# Altium schematic sheet Monitait_V2.SchDoc
size 889 x 508 mm
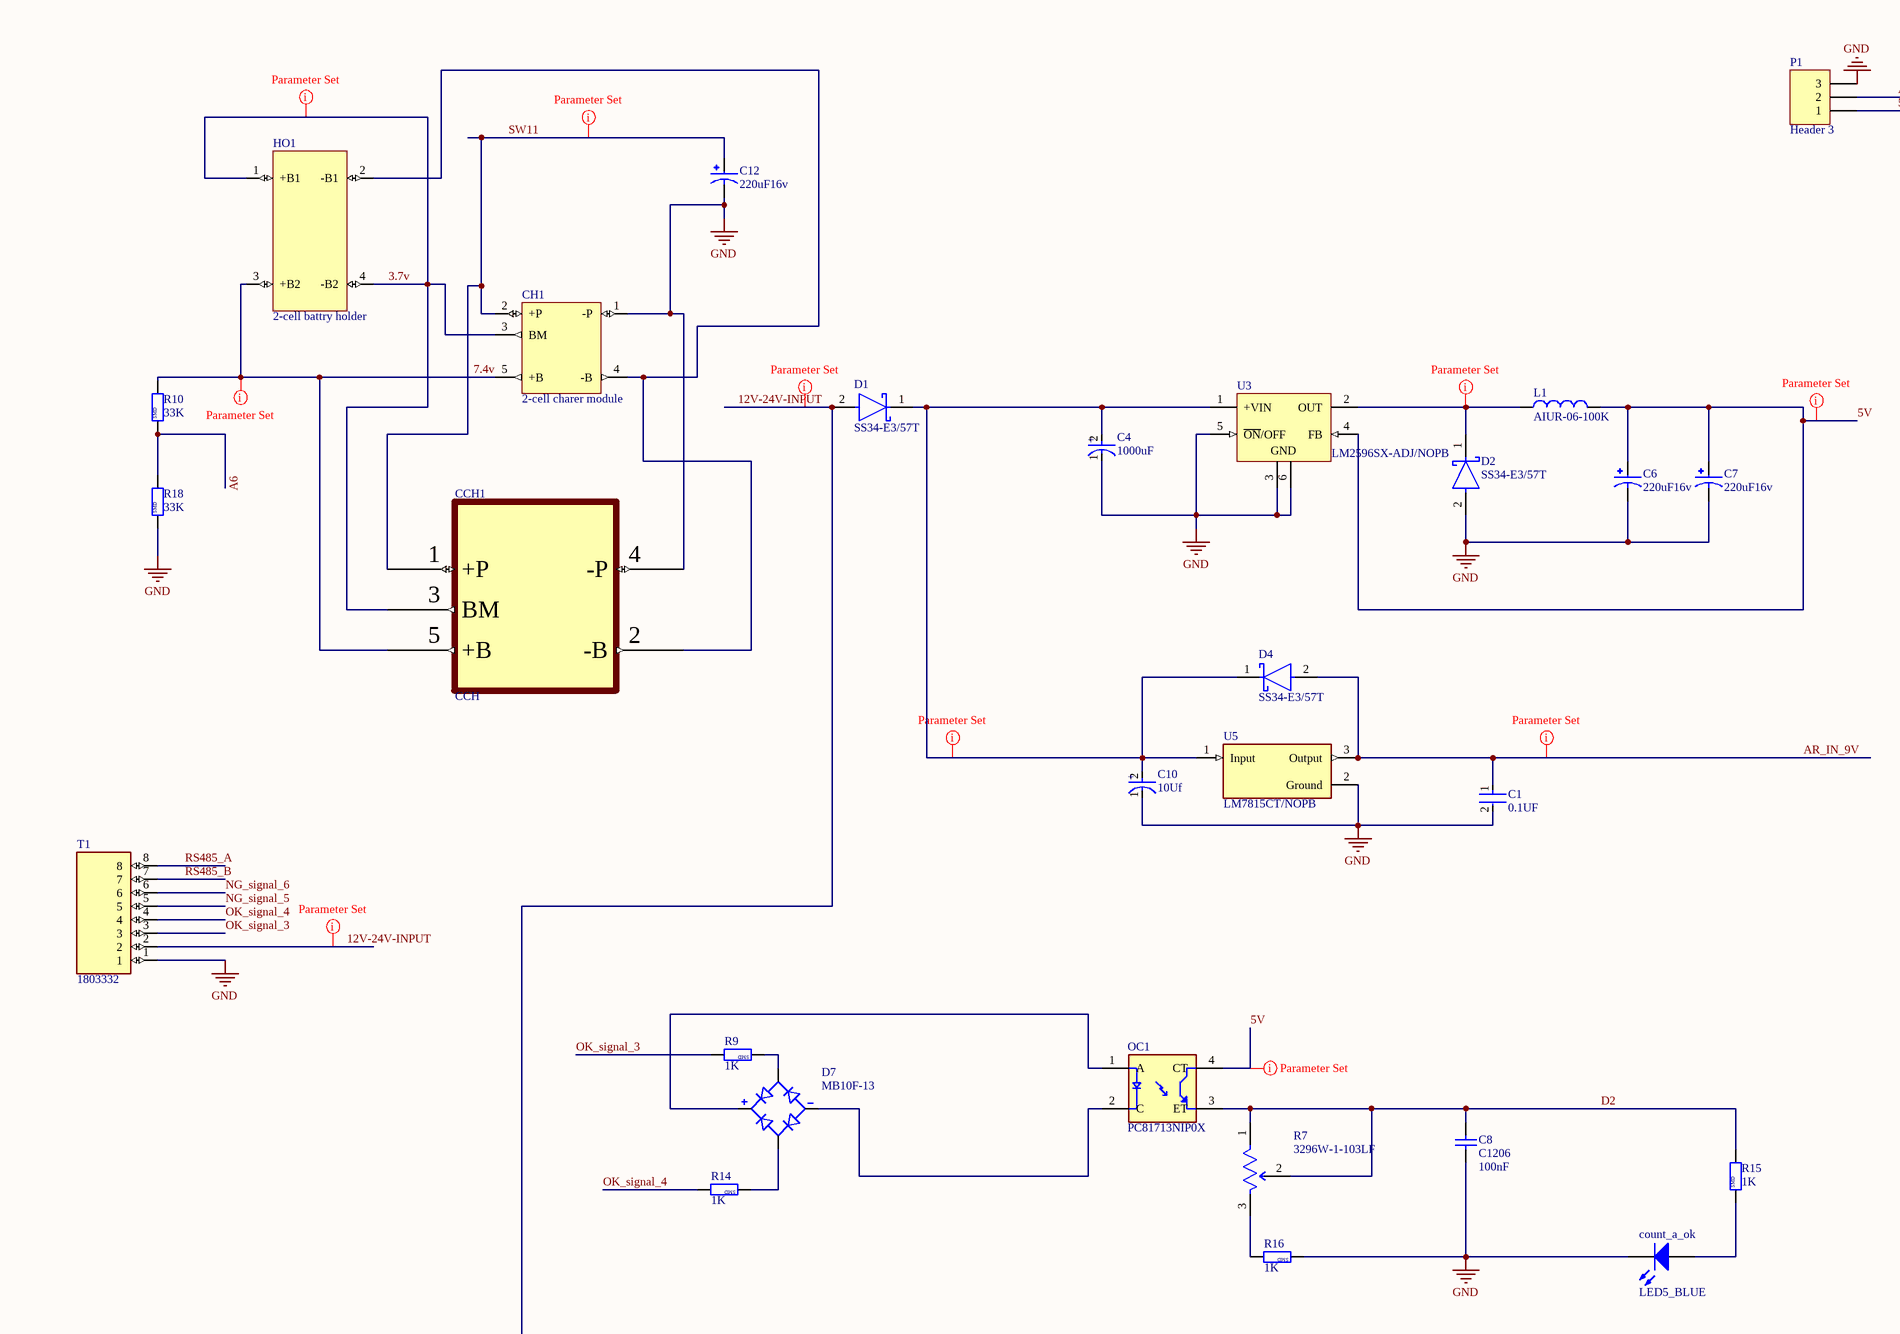
[diagram p0: Monitait_V2.SchDoc, top left]
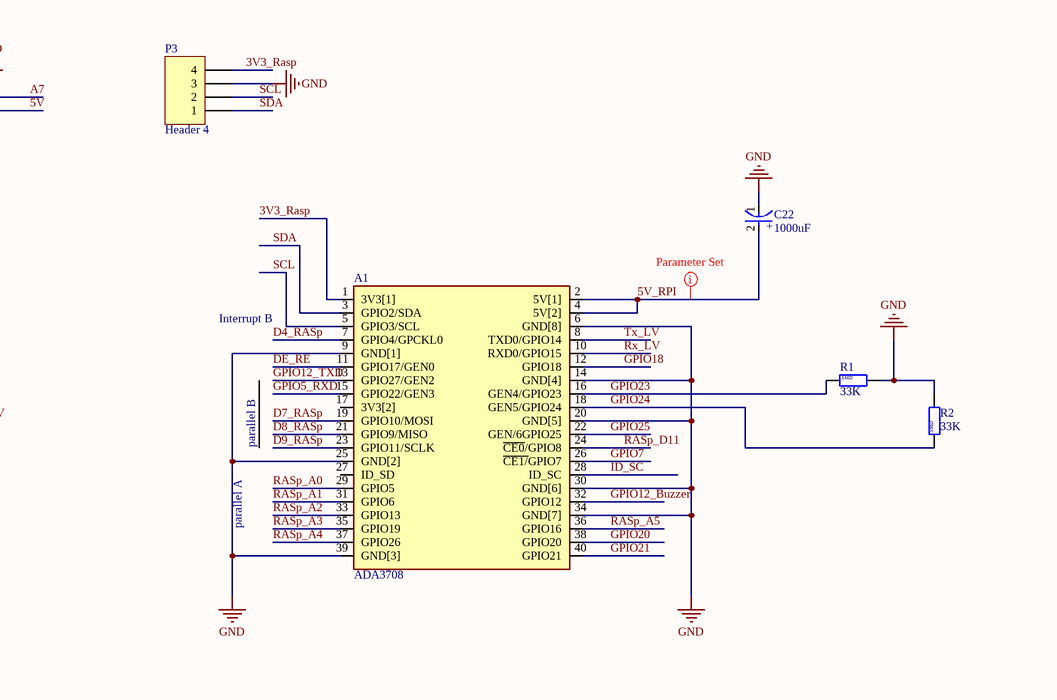
[diagram p1: Monitait_V2.SchDoc, top middle]
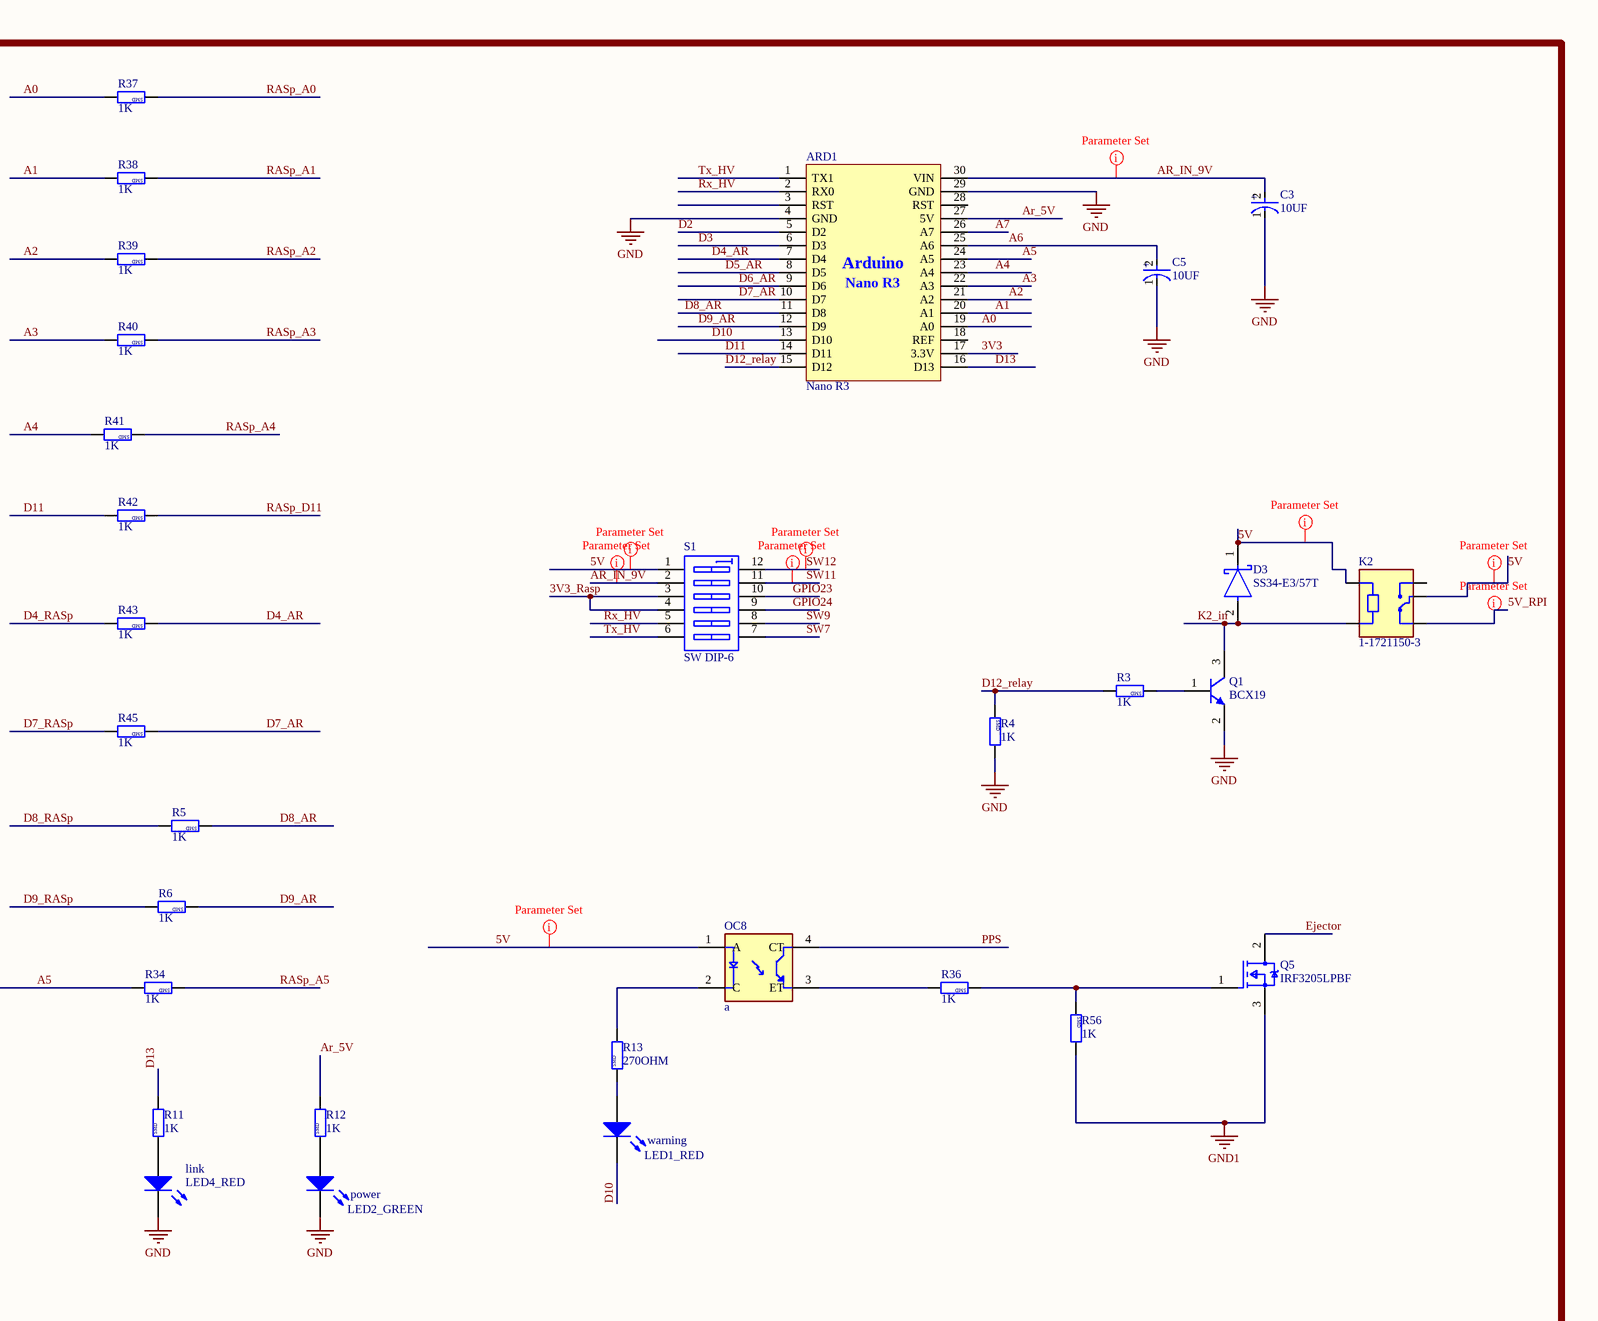
[diagram p2: Monitait_V2.SchDoc, top right]
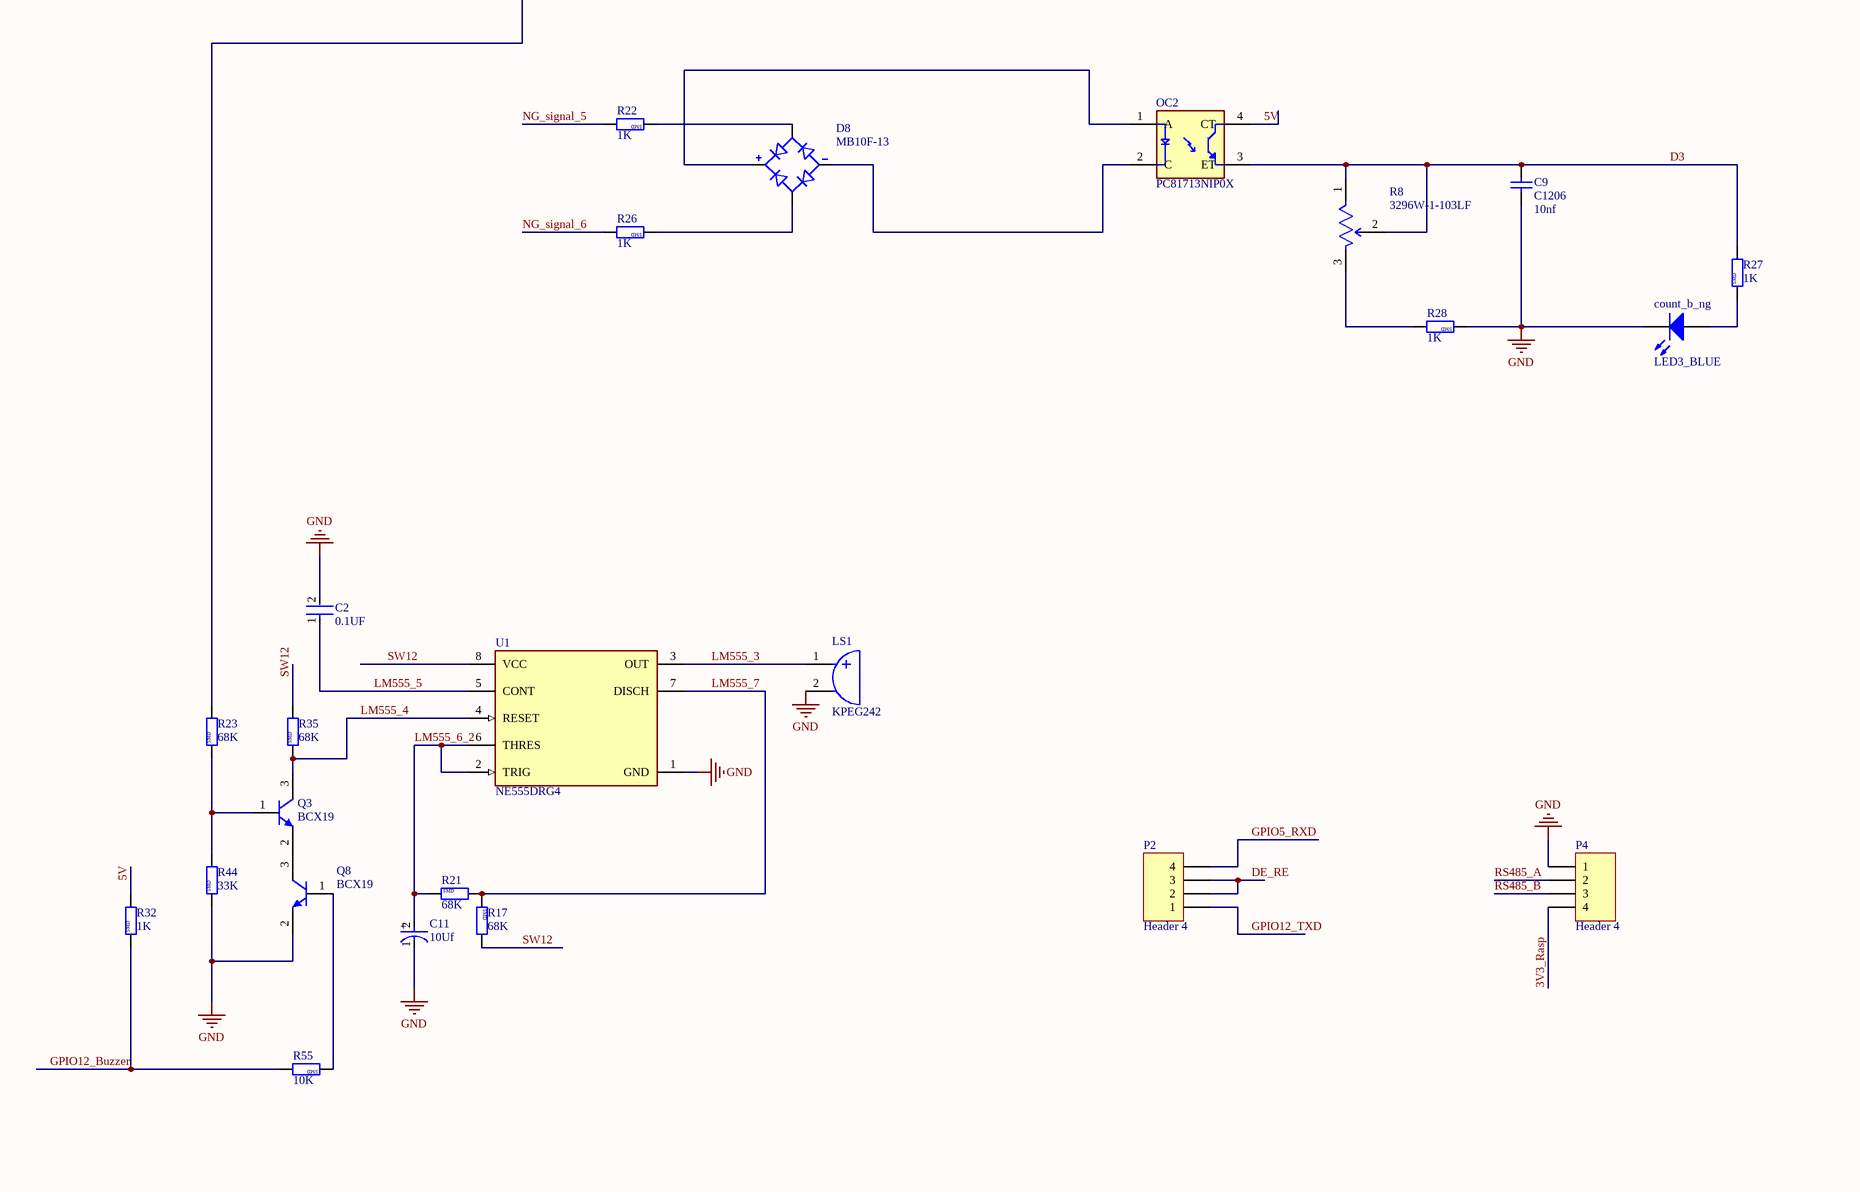
[diagram p3: Monitait_V2.SchDoc, bottom left]
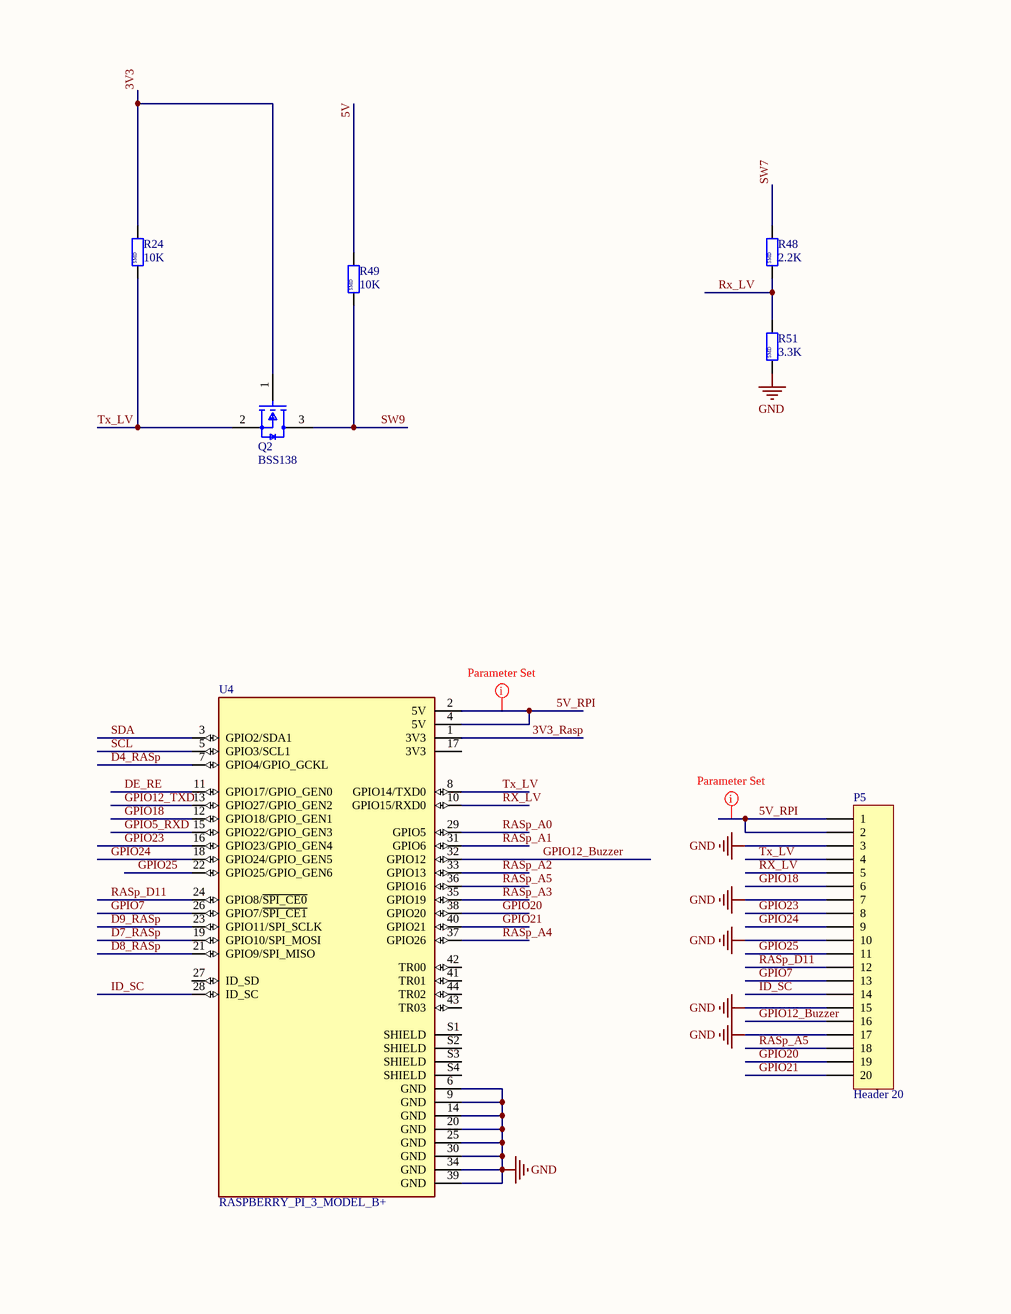
[diagram p4: Monitait_V2.SchDoc, bottom middle]
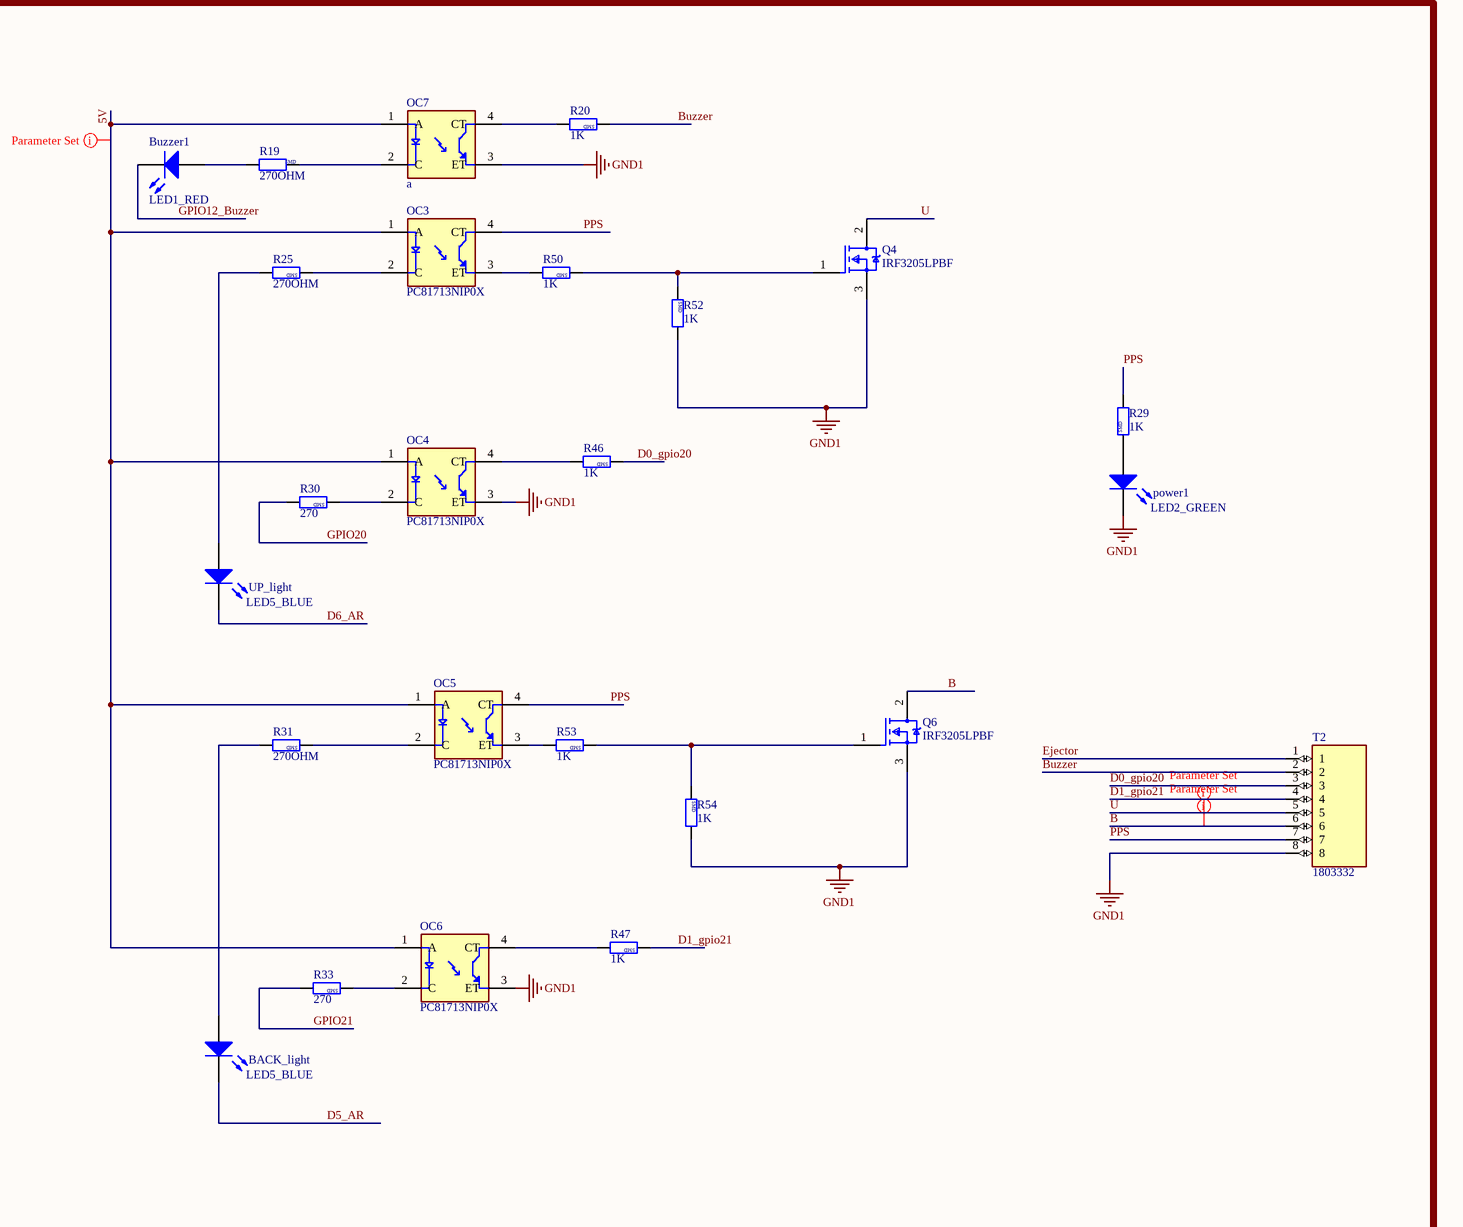
[diagram p5: Monitait_V2.SchDoc, bottom right]

## Parts
A1  ADA3708  [ADA3708_RPI-ZERO]
ARD1  Nano R3  [Arduino_Nano_R3]
BACK_light  LED5_BLUE  [LED-3mm]
Buzzer1  LED1_RED  [LED-3mm]
C1  0.1UF  [FP-1206-L_3_2_0_2-W_1_6_0-MFG]
C2  0.1UF  [FP-1206-L_3_2_0_2-W_1_6_0-MFG]
C3  10UF  [FP-TAJC-MFG]
C4  1000uF  [FP-RAD-TH-D_8_0_5-L_15_1-MFG]
C5  10UF  [FP-TAJC-MFG]
C6  220uF16v  [CAPPRD250W50D630H1650]
C7  220uF16v  [CAPPRD250W50D630H1650]
C8  C1206  value 100nF  [1206]
C9  C1206  value 10nf  [1206]
C10  10Uf  [FP-TAJC-MFG]
C11  10Uf  [FP-TAJC-MFG]
C12  220uF16v  [CAPPRD250W50D630H1650]
C22  1000uF  [FP-RAD-TH-D_8_0_5-L_15_1-MFG]
CCH1  CCH  [PCBComponent_1]
CH1  2-cell charer module  [PCBComponent_1]
count_a_ok  LED5_BLUE  [LED-3mm]
count_b_ng  LED3_BLUE  [LED-3mm]
D1  SS34-E3/57T  [FP-95402-MFG]
D2  SS34-E3/57T  [FP-95402-MFG]
D3  SS34-E3/57T  [FP-95402-MFG]
D4  SS34-E3/57T  [FP-95402-MFG]
D7  MB10F-13  [DIOB_MB10F-13]
D8  MB10F-13  [DIOB_MB10F-13]
HO1  2-cell battry holder  [PCBComponent_1]
K2  1-1721150-3  [RELAY_1-1721150-3]
L1  AIUR-06-100K  [ABRA-AIUR-06-2_V]
link  LED4_RED  [LED-3mm]
LS1  KPEG242  [KINGS-KPEG242-2]
OC1  PC81713NIP0X  [SOT254P1025X400-4N]
OC2  PC81713NIP0X  [SOT254P1025X400-4N]
OC3  PC81713NIP0X  [SOT254P1025X400-4N]
OC4  PC81713NIP0X  [SOT254P1025X400-4N]
OC5  PC81713NIP0X  [SOT254P1025X400-4N]
OC6  PC81713NIP0X  [SOT254P1025X400-4N]
OC7  a  [SOT254P1025X400-4N]
OC8  a  [SOT254P1025X400-4N]
P1  Header 3  [HDR1X3]
P2  Header 4  [HDR1X4]
P3  Header 4  [HDR1X4]
P4  Header 4  [HDR1X4]
P5  Header 20  [HDR1X20]
power  LED2_GREEN  [LED-3mm]
power1  LED2_GREEN  [LED-3mm]
Q1  BCX19  [ONSC-SOT-23-3-318-08_V]
Q2  BSS138  [FP-318-08-IPC_B]
Q3  BCX19  [ONSC-SOT-23-3-318-08_V]
Q4  IRF3205LPBF  [FP-PG-TO262-3-MFG]
Q5  IRF3205LPBF  [FP-PG-TO262-3-MFG]
Q6  IRF3205LPBF  [FP-PG-TO262-3-MFG]
Q8  BCX19  [ONSC-SOT-23-3-318-08_V]
R1  33K  [1206]
R2  33K  [1206]
R3  1K  [1206]
R4  1K  [1206]
R5  1K  [1206]
R6  1K  [1206]
R7  3296W-1-103LF  [FP-3296W-MFG]
R8  3296W-1-103LF  [FP-3296W-MFG]
R9  1K  [1206]
R10  33K  [1206]
R11  1K  [1206]
R12  1K  [1206]
R13  270OHM  [1206]
R14  1K  [1206]
R15  1K  [1206]
R16  1K  [1206]
R17  68K  [1206]
R18  33K  [1206]
R19  270OHM  [1206]
R20  1K  [1206]
R21  68K  [1206]
R22  1K  [1206]
R23  68K  [1206]
R24  10K  [1206]
R25  270OHM  [1206]
R26  1K  [1206]
R27  1K  [1206]
R28  1K  [1206]
R29  1K  [1206]
R30  270  [1206]
R31  270OHM  [1206]
R32  1K  [1206]
R33  270  [1206]
R34  1K  [1206]
R35  68K  [1206]
R36  1K  [1206]
R37  1K  [1206]
R38  1K  [1206]
R39  1K  [1206]
R40  1K  [1206]
R41  1K  [1206]
R42  1K  [1206]
R43  1K  [1206]
R44  33K  [1206]
R45  1K  [1206]
R46  1K  [1206]
R47  1K  [1206]
R48  2.2K  [1206]
R49  10K  [1206]
R50  1K  [1206]
R51  3.3K  [1206]
R52  1K  [1206]
R53  1K  [1206]
R54  1K  [1206]
R55  10K  [1206]
R56  1K  [1206]
S1  SW DIP-6  [DIP-12/SW]
T1  1803332  [SHDRRA8W83P0X381_1X8_3187X920X]
T2  1803332  [SHDRRA8W83P0X381_1X8_3187X920X]
U1  NE555DRG4  [FP-D0008A-IPC_A]
U3  LM2596SX-ADJ/NOPB  [KTT0005B_L]
U4  RASPBERRY_PI_3_MODEL_B+  [MODULE_RASPBERRY_PI_3_MODEL_B+]
U5  LM7815CT/NOPB  [FP-NDE0003B-MFG]
UP_light  LED5_BLUE  [LED-3mm]
warning  LED1_RED  [LED-3mm]

## Nets
GND: A1.6(GND[8]) A1.9(GND[1]) A1.14(GND[4]) A1.20(GND[5]) A1.25(GND[2]) A1.30(GND[6]) A1.34(GND[7]) A1.39(GND[3]) ARD1.4(GND) ARD1.29(GND) C1.2 C2.2 C3.1(C) C4.1(C) C5.1(C) C6.N C7.N C8.1 C9.1 C10.1(C) C11.1(C) C12.N C22.1(C) CCH1.4(-P) CH1.1(-P) count_a_ok.2(K) count_b_ng.2(K) D2.2(A) link.2(K) LS1.2 P1.3 P3.3 P4.1 P5.3 P5.7 P5.10 P5.15 P5.17 power.2(K) Q1.2(E) Q8.2(E) R1.2 R2.2 R4.2 R16.1 R18.1 R28.1 R44.1 R51.1 T1.1 U1.1(GND) U3.3(GND) U3.5(~{ON}/OFF) U3.6(GND) U4.6(GND) U4.9(GND) U4.14(GND) U4.20(GND) U4.25(GND) U4.30(GND) U4.34(GND) U4.39(GND) U5.2(Ground)
GND1: OC4.3(ET) OC6.3(ET) OC7.3(ET) power1.2(K) Q4.3(S) Q5.3(S) Q6.3(S) R52.2 R54.2 R56.2 T2.8
3.7v: CCH1.3(BM) CH1.3(BM) HO1.1(+B1) HO1.4(-B2)
3V3: ARD1.17(3.3V) Q2.1(G) R24.2
3V3_Rasp: A1.1(3V3[1]) P3.4 P4.4 S1.3(A3) S1.4(A4) U4.1(3V3)
5V: C6.P C7.P D3.1(C) K2.A1 K2.COM L1.2 OC1.4(CT) OC2.4(CT) OC3.1(A) OC4.1(A) OC5.1(A) OC6.1(A) OC7.1(A) OC8.1(A) P1.1 R32.2 R49.2 S1.1(A1) U3.4(FB)
5V_RPI: A1.2(5V[1]) A1.4(5V[2]) C22.2(A) K2.NC P5.1 P5.2 U4.2(5V) U4.4(5V)
7.4v: CCH1.5(+B) CH1.5(+B) HO1.3(+B2) R10.2
12V-24V-INPUT: D1.2(A) R23.2 T1.2
A0: ARD1.19(A0) R37.2
A1: ARD1.20(A1) R38.2
A2: ARD1.21(A2) R39.2
A3: ARD1.22(A3) R40.2
A4: ARD1.23(A4) R41.2
A5: ARD1.24(A5) R34.2
A6: ARD1.25(A6) C5.2(A) R10.1 R18.2
A7: ARD1.26(A7) P1.2
Ar_5V: ARD1.27(5V) R12.2
AR_IN_9V: ARD1.30(VIN) C1.1 C3.2(A) D4.2(A) S1.2(A2) U5.3(Output)
B: Q6.2(D) T2.6
Buzzer: R20.1 T2.2
D0_gpio20: R46.1 T2.3
D1_gpio21: R47.1 T2.4
D2: ARD1.5(D2) C8.2 OC1.3(ET) R7.1(CCW) R7.2(WIPER) R15.2
D3: ARD1.6(D3) C9.2 OC2.3(ET) R8.1(CCW) R8.2(WIPER) R27.2
D4_AR: ARD1.7(D4) R43.1
D4_RASp: A1.7(GPIO4/GPCKL0) R43.2 U4.7(GPIO4/GPIO_GCKL)
D5_AR: ARD1.8(D5) BACK_light.2(K)
D6_AR: ARD1.9(D6) UP_light.2(K)
D7_AR: ARD1.10(D7) R45.1
D7_RASp: A1.19(GPIO10/MOSI) R45.2 U4.19(GPIO10/SPI_MOSI)
D8_AR: ARD1.11(D8) R5.1
D8_RASp: A1.21(GPIO9/MISO) R5.2 U4.21(GPIO9/SPI_MISO)
D9_AR: ARD1.12(D9) R6.1
D9_RASp: A1.23(GPIO11/SCLK) R6.2 U4.23(GPIO11/SPI_SCLK)
D10: ARD1.13(D10) warning.2(K)
D11: ARD1.14(D11) R42.2
D12_relay: ARD1.15(D12) R3.2 R4.1
D13: ARD1.16(D13) R11.2
DE_RE: A1.11(GPIO17/GEN0) P2.2 P2.3 U4.11(GPIO17/GPIO_GEN0)
Ejector: Q5.2(D) T2.1
GPIO5_RXD: A1.15(GPIO22/GEN3) P2.4 U4.15(GPIO22/GPIO_GEN3)
GPIO7: A1.26(~{CE1/}GPIO7) P5.13 U4.26(GPIO7/~{SPI_CE1})
GPIO12_Buzzer: A1.32(GPIO12) Buzzer1.2(K) P5.16 R32.1 R55.2 U4.32(GPIO12)
GPIO12_TXD: A1.13(GPIO27/GEN2) P2.1 U4.13(GPIO27/GPIO_GEN2)
GPIO18: A1.12(GPIO18) P5.6 U4.12(GPIO18/GPIO_GEN1)
GPIO20: A1.38(GPIO20) P5.19 R30.2 U4.38(GPIO20)
GPIO21: A1.40(GPIO21) P5.20 R33.2 U4.40(GPIO21)
GPIO23: A1.16(GEN4/GPIO23) P5.8 R1.1 S1.10(B3) U4.16(GPIO23/GPIO_GEN4)
GPIO24: A1.18(GEN5/GPIO24) P5.9 R2.1 S1.9(B4) U4.18(GPIO24/GPIO_GEN5)
GPIO25: A1.22(GEN/6GPIO25) P5.11 U4.22(GPIO25/GPIO_GEN6)
ID_SC: A1.28(ID_SC) P5.14 U4.28(ID_SC)
K2_in: D3.2(A) K2.A2 Q1.3(C)
LM555_3: LS1.1 U1.3(OUT)
LM555_4: Q3.3(C) R35.1 U1.4(RESET)
LM555_5: C2.1 U1.5(CONT)
LM555_6_2: C11.2(A) R21.1 U1.2(TRIG) U1.6(THRES)
LM555_7: R17.1 R21.2 U1.7(DISCH)
NG_signal_5: R22.2 T1.5
NG_signal_6: R26.2 T1.6
OK_signal_3: R9.2 T1.3
OK_signal_4: R14.2 T1.4
PPS: OC3.4(CT) OC5.4(CT) OC8.4(CT) R29.2 T2.7
RASp_A0: A1.29(GPIO5) R37.1 U4.29(GPIO5)
RASp_A1: A1.31(GPIO6) R38.1 U4.31(GPIO6)
RASp_A2: A1.33(GPIO13) R39.1 U4.33(GPIO13)
RASp_A3: A1.35(GPIO19) R40.1 U4.35(GPIO19)
RASp_A4: A1.37(GPIO26) R41.1 U4.37(GPIO26)
RASp_A5: A1.36(GPIO16) P5.18 R34.1 U4.36(GPIO16)
RASp_D11: A1.24(~{CE0}/GPIO8) P5.12 R42.1 U4.24(GPIO8/~{SPI_CE0})
RS485_A: P4.2 T1.8
RS485_B: P4.3 T1.7
Rx_HV: ARD1.2(RX0) S1.5(A5)
Rx_LV: A1.10(RXD0/GPIO15) P5.5 R48.1 R51.2 U4.10(GPIO15/RXD0)
SCL: A1.5(GPIO3/SCL) P3.2 U4.5(GPIO3/SCL1)
SDA: A1.3(GPIO2/SDA) P3.1 U4.3(GPIO2/SDA1)
SW7: R48.2 S1.7(B6)
SW9: Q2.3(D) R49.1 S1.8(B5)
SW11: C12.P CCH1.1(+P) CH1.2(+P) S1.11(B2)
SW12: R17.2 R35.2 S1.12(B1) U1.8(VCC)
Tx_HV: ARD1.1(TX1) S1.6(A6)
Tx_LV: A1.8(TXD0/GPIO14) P5.4 Q2.2(S) R24.1 U4.8(GPIO14/TXD0)
U: Q4.2(D) T2.5
NetBACK_light_1: BACK_light.1(A) R31.2
NetBuzzer1_1: Buzzer1.1(A) R19.2
NetC4_2: C4.2(A) C10.2(A) D1.1(C) D4.1(C) U3.1(+VIN) U5.1(Input)
NetCCH1_2: CCH1.2(-B) CH1.4(-B) HO1.2(-B1)
Netcount_a_ok_1: count_a_ok.1(A) R15.1
Netcount_b_ng_1: count_b_ng.1(A) R27.1
NetD2_1: D2.1(C) L1.1 U3.2(OUT)
NetD7_1: D7.1(POS) OC1.1(A)
NetD7_2: D7.2(AC1) R9.1
NetD7_3: D7.3(NEG) OC1.2(C)
NetD7_4: D7.4(AC2) R14.1
NetD8_1: D8.1(POS) OC2.1(A)
NetD8_2: D8.2(AC1) R22.1
NetD8_3: D8.3(NEG) OC2.2(C)
NetD8_4: D8.4(AC2) R26.1
Netlink_1: link.1(A) R11.1
NetOC3_2: OC3.2(C) R25.1
NetOC3_3: OC3.3(ET) R50.2
NetOC4_2: OC4.2(C) R30.1
NetOC4_4: OC4.4(CT) R46.2
NetOC5_2: OC5.2(C) R31.1
NetOC5_3: OC5.3(ET) R53.2
NetOC6_2: OC6.2(C) R33.1
NetOC6_4: OC6.4(CT) R47.2
NetOC7_2: OC7.2(C) R19.1
NetOC7_4: OC7.4(CT) R20.2
NetOC8_2: OC8.2(C) R13.2
NetOC8_3: OC8.3(ET) R36.2
Netpower1_1: power1.1(A) R29.1
Netpower_1: power.1(A) R12.1
NetQ1_1: Q1.1(B) R3.1
NetQ3_1: Q3.1(B) R23.1 R44.2
NetQ3_2: Q3.2(E) Q8.3(C)
NetQ4_1: Q4.1(G) R50.1 R52.1
NetQ5_1: Q5.1(G) R36.1 R56.1
NetQ6_1: Q6.1(G) R53.1 R54.1
NetQ8_1: Q8.1(B) R55.1
NetR7_3: R7.3(CW) R16.2
NetR8_3: R8.3(CW) R28.2
NetR13_1: R13.1 warning.1(A)
NetR25_2: R25.2 UP_light.1(A)

Not connected (* = marked no-connect by the designer): A1 17(3V3[2]) 27(ID_SD); ARD1 3(RST) 18(REF) 28(RST); K2 NO; U4 17(3V3) 27(ID_SD) 41(TR01) 42(TR00) 43(TR03) 44(TR02) S1(SHIELD) S2(SHIELD) S3(SHIELD) S4(SHIELD)

## Layout directives
rule Width Constraint [Pref Width = 1mm    Min Width = 0.254mm    Max Width = 2mm]: 3.7v, 5V, 5V_RPI, 7.4v, 12V-24V-INPUT, AR_IN_9V, B, NetC4_2, NetD2_1, SW11, SW12, U
rule Width Constraint [Pref Width = 1mm    Min Width = 0.254mm    Max Width = 0.254mm]: 5V

## Notes on the sheet
- Interrupt B
- parallel B
- parallel A
- (in symbol Arduino Nano R3) Arduino
- (in symbol CMP-04424-000120-1) +
- (in symbol CMP-05427-001033-1) +
- (in symbol Resistor SMD) SMD

## Library data of the parts
A1 = ADA3708: Raspberry Pi Zero WH (Zero W with Headers); MP: ADA3708; Availability: Unavailable; Package: None; Value: *; Price: None
ARD1 = Arduino Nano R3
BACK_light count_a_ok count_b_ng link power power1 UP_light warning = LED 3mm: Typical LED; Designer: Seyed Mohsen Ghasemian; Published: 02/04/2012; PackageReference: LED; Publisher: www.picpars.com; PackageDescription: LED; 2 Leads
Buzzer1 = LED 3mm_2: Typical LED; Designer: Seyed Mohsen Ghasemian; Published: 02/04/2012; PackageReference: LED; Publisher: www.picpars.com; PackageDescription: LED; 2 Leads
C1 C2 = CMP-2000-05018-2: General Purpose Ceramic Capacitor, 1206, 100nF, 10%, X7R, 15%, 50V; Dissipation Factor: 2.5%; Insulation Resistance: 100GR; Dielectric: X7R; Thickness: 0.037inch; Case Code (Imperial): 1206; Case Code (Metric): 3216; Dielectric Material: Ceramic; Width: 1.6mm; Voltage Rating (DC): 50V; Termination: SMD/SMT; Tolerance: 10%; REACH SVHC: No SVHC; Height: 0.94mm; Length: 3.2mm; Voltage: 50V; Capacitance: 100nF; Packaging: Tape and Reel; Depth: 1.6mm; Voltage Rating: 50V; Series: -; Contact Plating: Tin; Mount: Surface Mount; Package Quantity: 1; Construction: Flat; Max Operating Temperature: 125°C; Min Operating Temperature: -55°C; Case/Package: 1206; Lead Free: Lead Free; RoHS Compliant: Yes; Number of Pins: 2; Radiation Hardening: No
C3 C5 C10 C11 = CMP-04424-000120-1: 10uF 35V  ±10% 1.6Ω 2312  SMD Tantalum Capacitor; Polarity: Polar; ESR (Equivalent Series Resistance): 1.6R; Voltage: 25V; Leakage Current: 3.5uA; Dissipation Factor: 6%; Tolerance: 20%; Voltage Rating (DC): 35V; Width: 3.2mm; Package Quantity: 1; Length: 6mm; REACH SVHC: No SVHC; Construction: Flat; Depth: 3.2mm; RoHS Compliant: Yes; Height - Seated (Max): 0.11inch; Dielectric Material: Tantalum; Max Operating Temperature: 125°C; Termination: SMD/SMT; Capacitance: 10uF; Series: TAJ; Lead Free: Lead Free; Radiation Hardening: No; Case/Package: Molded; Case Code (Metric): 6032; Features: General Purpose; Voltage Rating: 35V; Min Operating Temperature: -55°C; Case Code (Imperial): 2412; Mount: Surface Mount; Packaging: Tape and Reel; Height: 2.6mm; Number of Pins: 2
C4 C22 = CMP-05427-001033-1: Aluminum Electrolytic Capacitors (Radial Lead Type) 1000uF ±20% 10V; Ripple Current: 1.24A; Impedance: 41mR; Capacitance: 1mF; Lead Diameter: 0.6mm; Lead/Base Style: Straight; Life (Hours): 8000Hour; Dissipation Factor: 0.19%; Min Operating Temperature: -40°C; Height - Seated (Max): 0.65inch; Packaging: Bulk; Lead Pitch: 3.5mm; Max Operating Temperature: 105°C; Ripple Current (AC): 1.24A; ESR (Equivalent Series Resistance): 41mR; Construction: RADIAL; Voltage Rating: 10V; Voltage: 10V; Mount: Through Hole; Radiation Hardening: No; Termination: Radial; RoHS Compliant: Yes; Length: 15mm; REACH SVHC: No SVHC; Tolerance: 20%; Case/Package: Radial; Contact Plating: Tin; Height: 15mm; Series: FR; Diameter: 8mm; Voltage Rating (DC): 10V; Package Quantity: 200; Number of Pins: 2
C6 C7 C12 = UPM1C181MED1TD: Cap Aluminum Lytic 180uF 16V 20% (6.3 X 15mm) Radial 2.5mm 285mA 2000h 105Â°C Ammo; MF: Nichicon; SnapEDA_Link: https://www.snapeda.com/parts/UPM1C181MED1TD/Nichicon/view-part/?ref=snap; Package: None; Value: *; MP: UPM1C181MED1TD; Check_prices: https://www.snapeda.com/parts/UPM1C181MED1TD/Nichicon/view-part/?ref=eda
C8 C9 = C1206: Ceramic Chip Capacitor - Standard; Published: 17-Jul-2002; LatestRevisionDate: 19-Mar-2004; LatestRevisionNote: Silkscreen size reduced.; DatasheetDocument: Mar-2001; PackageDocument: Mar-2001; PackageReference: 1206; Publisher: Altium Limited; Code_JEITA: 1206; Code_IPC: 3216 [1206]; ComponentLink1Description: Manufacturer Link; ComponentLink1URL: http://www.kemet.com/; ComponentLink2Description: Datasheet; ComponentLink2URL: http://www.kemet.com/kemet/web/homepage/kechome.nsf/vapubfilesname/F3102TA.pdf/$file/F3102TA.pdf
CH1 = 2-cell charger module
D1-D4 = CMP-02539-000012-1: DIODE SCHOTTKY 40V 3A DO214AB; Manufacturer: Vishay; Max Junction Temp: +150°C; Peak Reverse Current: 0.5mA; Max Surge Forward Current: 100A; Standoff Height: 0mm; ComponentLink2Description: Datasheet; Device Class L3: Schottky Diodes; Height: 2.62mm; Max Repetitive Reverse Voltage: 40V; Lead Free: Yes; Package: 95402; Temperature Range High: +150°C; ComponentLink2URL: http://www.vishay.com/docs/88751/ss32.pdf; Temperature: -55°C to +150°C; Footprint Url: http://www.vishay.com/docs/95402/smc.pdf; Automotive: No; Forward Current: 3A; Category: Diode; Manufacturer Part Number: SS34-E3/57T; RoHS: TRUE; Device Class L2: Diodes; Mouser Description: Schottky Diodes & Rectifiers 3.0 Amp 40 Volt; Octopart: https://octopart.com/ss34-e3%2F57t-vishay-39552907; Temperature Range Low: -55°C; Device Class L1: Discrete Semiconductors; Digikey Description: DIODE SCHOTTKY 40V 3A DO214AB
D7 D8 = MB10F-13: Bridge Rectifier Single Phase Standard 1 kV Surface Mount MBF; MF: Diodes Inc.; Check_prices: https://www.snapeda.com/parts/MB10F-13/Diodes+Inc./view-part/?ref=eda; Value: *; Availability: In Stock; MP: MB10F-13; Price: None; Package: SMD-4 Diodes Inc.; SnapEDA_Link: https://www.snapeda.com/parts/MB10F-13/Diodes+Inc./view-part/?ref=snap; Purchase-URL: https://pricing.snapeda.com/search/part/MB10F-13/?ref=eda
K2 = 1-1721150-3: ORWH Series Miniature PCB Relay with Wash Tight 1-Pole 1-Form C 1 CO 12 VDC 400 Ohm 360 mW Silver Zinc Oxide; Package: None; Availability: Unavailable; Value: *; MP: 1-1721150-3; Price: None
L1 = CMP-2000-05038-1: Fixed Inductor, 10 uH, +/- 10%, -40 to 85 degC, 2-Pin THD, RoHS, Bulk; Manufacturer: ABRACON; Case Length: 18mm; Type: ThruHolePowerInductor; Inductance: 10uH; Case Diameter: 12.7mm; Maximum DC Resistance: 0.031Ohms; Core Material: Ferrite; Shielding: Unshielded; Maximum DC Current: 8.8A; Lead Diameter: 0.81mm; Package / Case: 12.7mmx18mm; Packaging: Bulk; Series: AIUR-06; Package Reference: AIUR-06; RoHS: Details; Tolerance: 10%; Product: PowerInductors; Manufacturer URL: http://www.abracon.com/; Package Description: 2-Pin Through Hole Device, Dia 12.7 mm, Pitch 7.37 mm; Factory Pack Quantity: 250; Product Category: FixedInductors; Datasheet URL: http://www.abracon.com/Magnetics/radial/AIUR05-06.pdf; Brand: ABRACON; Operating Temperature Range: -40Cto+125C; Lead Spacing: 7.37mm; Termination Style: Radial; Datasheet Version: Rev. 1.1, 08/2004
LS1 = CMP-2000-06518-1: Piezo Indicator, 4100 Hz, 3 to 16 V, -20 to 70 degC, 2-Pin THD, RoHS; PartNumber: KPE-242; Manufacturer: KingstateElectronicsCorp.; Frequency Range: 3600to4600Hz; Maximum Supply Current: 7mA; Typical Operating Supply Voltage: 12Vdc; Product Height: 7.6mm; Current - Max: 7A; Tone Mode: Continuous; Product Diameter: 13.7mm; Minimum Sound Pressure: 70dBA; Maximum Resonant Frequency: 4600Hz; Type: Indicator; Datasheet URL: https://datasheet.ciiva.com/11776/0900766b8068f3a2-11776713.pdf; Mounting: ThroughHole; Technology: Piezo; Operating Temperature: -20to70°C; Category: AudioIndicatorsandAlerts; Termination Method: Pin; Manufacturer URL: http://www.kingstate.com.tw/index.php/en/; Package Description: 2-Pin Through Hole Device, Body Dia 13.7 mm, Pitch 7.62 mm; Datasheet Version: 01/2006; Package Reference: KPEG242; Mounting Technology: ThroughHole
OC1-OC8 = PC81713NIP0X: Optoisolator Transistor Output 5000Vrms 1 Channel 4-SMD; MF: SHARP/Socle Technology; MP: PC81713NIP0X; Purchase-URL: https://pricing.snapeda.com/search/part/PC81713NIP0X/?ref=eda; SnapEDA_Link: https://www.snapeda.com/parts/PC81713NIP0X/SHARP%252FSocle+Technology/view-part/?ref=snap; Package: SMD-4 SOCLE Technology; Availability: In Stock; Check_prices: https://www.snapeda.com/parts/PC81713NIP0X/SHARP%252FSocle+Technology/view-part/?ref=eda; Value: *; Price: None
P1 = Header 3: Header, 3-Pin; LatestRevisionDate: 17-Jul-2002; LatestRevisionNote: Re-released for DXP Platform.; Publisher: Altium Limited
P2-P4 = Header 4: Header, 4-Pin; LatestRevisionDate: 17-Jul-2002; LatestRevisionNote: Re-released for DXP Platform.; Publisher: Altium Limited
P5 = Header 20: Header, 20-Pin; LatestRevisionDate: 17-Jul-2002; LatestRevisionNote: Re-released for DXP Platform.; Publisher: Altium Limited
Q1 Q3 Q8 = CMP-1048-00828-1: 45 V, 0.5 A, NPN Transistor, 3-Pin SOT-23, Pb-Free, Tape and Reel; Manufacturer: On Semiconductor; PartNumber: BCX19LT1G; IC Continuous (A): 0.5; ComponentLink2Description: Datasheet; ComponentLink3URL: http://www.onsemi.cn/pub_link/Collateral/318-08.PDF; Packing: Tape and Reel; ComponentLink2URL: http://www.onsemi.com/pub_link/Collateral/BCX17LT1-D.PDF; ComponentLink3Description: Package Specification; PackageVersion: Rev. AP, 11/2009; Polarity: NPN; PackageDescription: 3-Pin Small Outline Transistor, Body 2.92 x 1.3 mm, Pitch 0.95 mm; PackageReference: SOT-23-3-318-08; Mounting Technology: Surface Mount; ComponentLink1URL: http://www.onsemi.com/; RoHS: TRUE; ComponentLink1Description: Manufacturer URL; DatasheetVersion: Rev. 7
Q2 = CMP-07173-000101-1: MOSFET N-CH 50V 220MA SOT-23; Turn-Off Delay Time: 20ns; Element Configuration: Single; Rds On Max: 3.5R; Gate to Source Voltage (Vgs): 20V; Threshold Voltage: 1.3V; Number of Elements: 1; Power Dissipation: 360mW; Rise Time: 9ns; Turn-On Delay Time: 2.5ns; Input Capacitance: 27pF; On-State Resistance: 6R; Lead Free: Lead Free; Length: 2.92mm; Width: 1.3mm; Drain to Source Breakdown Voltage: 50V; Min Operating Temperature: -55°C; REACH SVHC: No SVHC; Packaging: Tape and Reel; Radiation Hardening: No; Height: 0.93mm; Drain to Source Voltage (Vdss): 50V; Current Rating: 220mA; Voltage Rating (DC): 50V; Weight: 0.03g; Continuous Drain Current (ID): 220mA; Number of Pins: 3; Nominal Vgs: 1.3V; Max Power Dissipation: 360mW; Fall Time: 9ns; Drain to Source Resistance: 3.5R; Contact Plating: Tin; Case/Package: SOT-23; Package Quantity: 1; Dual Supply Voltage: 50V; Mount: Surface Mount; Termination: SMD/SMT; Max Operating Temperature: 150°C
Q4-Q6 = CMP-00196-65873332-1: IRF3205LPBF 55V Single N-Channel HEXFET Power MOSFET in a TO-262 package, TO262-3, RoHS; Max Junction Temperature (Tj): 175°C; Rise Time: 101ns; Threshold Voltage: 4V; Fall Time: 65ns; On-State Resistance: 8mΩ; Input Capacitance: 3.247nF; Max Power Dissipation: 200W; Turn-Off Delay Time: 50ns; Continuous Drain Current (ID): 110A; Turn-On Delay Time: 14ns; Gate to Source Voltage (Vgs): 20V; Number of Elements: 1; Width: 4.826mm; Length: 10.668mm; RoHS: Compliant; Max Operating Temperature: 175°C; Min Operating Temperature: -55°C; Package Quantity: 1000; Number of Pins: 3; Lifecycle Status: Production; Drain to Source Breakdown Voltage: 55V; NexarPartId: 65873332; Current Rating: 110A; Packaging: Bulk; Voltage Rating (DC): 55V; Height: 9.65mm; Radiation Hardening: No; Mount: Through Hole; Drain to Source Resistance: 8mΩ; Case/Package: TO-262; Lead Free: Contains Lead, Lead Free; Rds On Max: 8mΩ; REACH SVHC: No SVHC; Power Dissipation: 200W; Drain to Source Voltage (Vdss): 55V; Schedule B: 8541290080, 8541290080
R1-R6 R9-R56 = Resistor SMD: Resistor; Published: 8-Jun-2000; LatestRevisionDate: 17-Jul-2002; LatestRevisionNote: Re-released for DXP Platform.; PackageReference: AXIAL-0.4; Publisher: Altium Limited; PackageDescription: Axial Device, Thru-Hole; 2 Leads; 0.4 in Pin Spacing
  R1 R2 R10 R18 R44: Value: 33K
  R3-R6 R9 R11 R12 R14-R16 R20 R22 R26-R29 R32 R34 R36-R43 R45-R47 R50 R52-R54 R56: Value: 1K
  R13 R19 R25 R31: Value: 270OHM
  R17 R21 R23 R35: Value: 68K
  R24 R49 R55: Value: 10K
  R30 R33: Value: 270
  R48: Value: 2.2K
  R51: Value: 3.3K
R7 R8 = CMP-1747-00001-8: TRIMMER 10K OHM 0.5W PC PIN TOP; Number of Turns: 25; Tolerance: 10%; Resistance: 10kR; Max Power Dissipation: 500mW; Temperature Coefficient: 100ppm/°C; Insulation Resistance: 1GR; Min Operating Temperature: -55°C; Resistor Type: Cermet; Series: 3296; Color: Blue; Mount: Through Hole; Taper: Linear; Radiation Hardening: No; RoHS Compliant: Yes; Width: 9.53mm; Resistance Tolerance: 10%; Contact Plating: Tin; Military Standard: Not; Package Quantity: 50; Weight: 0.03oz; Lead Free: Lead Free; Power Rating: 500mW; Termination: Pin; Technology: CERMET; Max Operating Temperature: 125°C; Packaging: Rail/Tube; Length: 9.53mm; Depth: 4.83mm; Height: 11.55mm; Reach SVHC Compliant: Yes
S1 = SW DIP-6: DIP Switch, 6 Position, SPST; Published: 24-Mar-1999; LatestRevisionDate: 17-Jul-2002; LatestRevisionNote: Re-released for DXP Platform.; PackageReference: DIP-12/SW; Publisher: Altium Limited; PackageDescription: DIP Switch; 12 Leads
T1 T2 = 1803332: 8 Position Terminal Block Header, Male Pins, Shrouded (4 Side) 0.150 (3.81mm) 90Â°, Right Angle - Through Hole; MF: Phoenix Contact; Package: None; Price: None; Check_prices: https://www.snapeda.com/parts/1803332/Phoenix+Contact/view-part/?ref=eda; Value: *; SnapEDA_Link: https://www.snapeda.com/parts/1803332/Phoenix+Contact/view-part/?ref=snap; MP: 1803332; Availability: In Stock; Purchase-URL: https://pricing.snapeda.com/search?q=1803332&ref=eda
U1 = CMP-04858-000027-1: IC OSC SGL TIMER 100KHZ 8-SOIC; Number of Timers/Counters: 1; Min Supply Voltage: 4.5V; Quiescent Current: 15mA; Nominal Supply Current: 2mA; Max Supply Voltage: 16V; Low Level Output Current: 200mA; Operating Supply Current: 10mA; High Level Output Current: -200mA; Height: 1.58mm; Max Operating Temperature: 70°C; Case/Package: SOIC; Package Quantity: 2500; RoHS Compliant: Yes; Min Operating Temperature: 0°C; Frequency: 100kHz; Width: 3.91mm; Mount: Surface Mount; Number of Pins: 8; Packaging: Tape and Reel; Supply Current: 2mA; Length: 4.9mm; Series: -; Weight: 0.002561oz; Radiation Hardening: No; Lead Free: Lead Free
U3 = CMP-2000-06545-1: Simple Switcher(R) Power Converter 150 kHz Step-Down Voltage Regulator, 3 A, 4.5 to 40 V, -40 to 125 degC, 5-Pin TO-263 (KTT), Green (RoHS & no Sb/Br), Tape and Reel; PartNumber: LM2596; Manufacturer: Texas Instruments; Package Version: 4200577-4/G, 01/2013; Primary Input Voltage: 40V; No. of Outputs: 1; No. of Pins: 5; SVHC: NoSVHC(19-Dec-2012); Output Voltage: 37V; Output Current: 3A; Datasheet Version: Rev. C, 04/2013; Package Reference: KTT5; MSL: MSL3-168hours; Number of Outputs: 1; Operating Temperature Min: -40°C; Operating Temperature Range: -40°Cto+125°C; Manufacturer URL: http://www.ti.com/; Package URL: http://www.ti.com/litv/pdf/mpsf007e; Voltage Regulator Case Style: TO-263; Operating Temperature Max: 125°C; Package Description: 5-Pin Plastic Flange Mount, Body 10.16 x 8.925 mm, Pitch 1.7 mm; Datasheet URL: http://www.ti.com/lit/ds/symlink/lm2596.pdf; Mounting Technology: SurfaceMount
U4 = RASPBERRY_PI_3_MODEL_B+: Case Plastic, ABS Black Hand Held, Split Sides 3.520 L x 2.740 W (89.41mm x 69.60mm) X 0.980 (24.89mm); MF: Raspberry Pi; MP: RASPBERRY PI 3 MODEL B+; Purchase-URL: https://pricing.snapeda.com/search/part/RASPBERRY PI 3 MODEL B+/?ref=eda; Check_prices: https://www.snapeda.com/parts/RASPBERRY%20PI%203%20MODEL%20B+/Raspberry+Pi/view-part/?ref=eda; SnapEDA_Link: https://www.snapeda.com/parts/RASPBERRY%20PI%203%20MODEL%20B+/Raspberry+Pi/view-part/?ref=snap; Price: None; Availability: In Stock; Package: Raspberry Pi; Value: *
U5 = CMP-04917-000014-1: IC REG LINEAR 15V 1A TO220-3; Manufacturer: Texas Instruments; Accuracy Percentage: 3%; Nominal Supply Current: 8mA; Standoff Height: 3.3mm; Min Supply Voltage: 7.5V; Number Of Outputs: 1; Max Supply Voltage: 30V; Dropout Voltage: 2V; Output Current: 1.5A; Output Type: Fixed; Max Junction Temp: +150°C; Device Class L2: Power Management ICs; Temperature: 0°C to +125°C; Automotive: No; ComponentLink2URL: http://www.ti.com/lit/ds/symlink/lm7800.pdf; Lead Free: Yes; Temperature Range High: +125°C; Digikey Description: IC REG LINEAR 15V 1A TO220-3; Package: NDE0003B; Ipc Land Pattern Name: TO-220; Manufacturer Part Number: LM7815CT/NOPB; Category: IC; Device Class L3: Voltage Regulators - Linear; RoHS: TRUE; ComponentLink2Description: Datasheet; Output Voltage: 15V; Height: 19.55mm; Temperature Range Low: 0°C; Device Class L1: Integrated Circuits (ICs); Mouser Description: Linear Voltage Regulators 15 Volt Reg; Octopart: https://octopart.com/lm7815ct%2Fnopb-texas+instruments-23919376